# Altium schematic sheet Main.SchDoc
size A
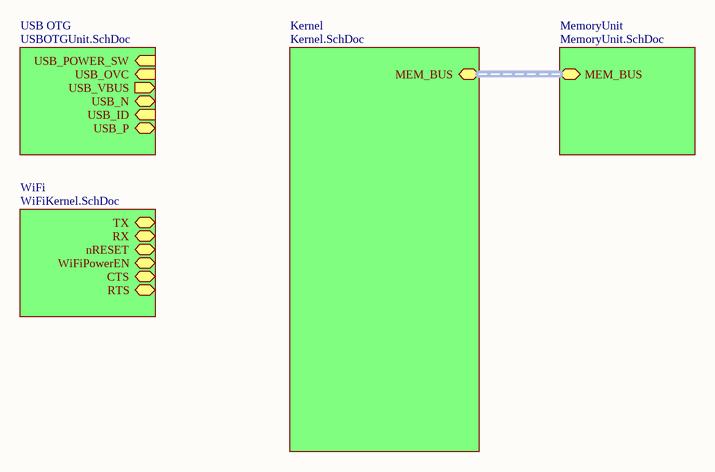
[diagram p0: Main.SchDoc]

## Sub-sheets
Kernel = Kernel.SchDoc: MEM_BUS (harness MEM_BUS)
MemoryUnit = MemoryUnit.SchDoc: MEM_BUS (harness MEM_BUS)
USB OTG = USBOTGUnit.SchDoc: USB_POWER_SW (in), USB_OVC (in), USB_VBUS (out), USB_N (bidir), USB_ID (in), USB_P (bidir)
WiFi = WiFiKernel.SchDoc: TX, RX, nRESET, WiFiPowerEN, CTS, RTS

## Buses and harness runs
harness sheet Kernel/MEM_BUS = sheet MemoryUnit/MEM_BUS